# EAGLE schematic nixi-test-board (EAGLE 7.2.0)
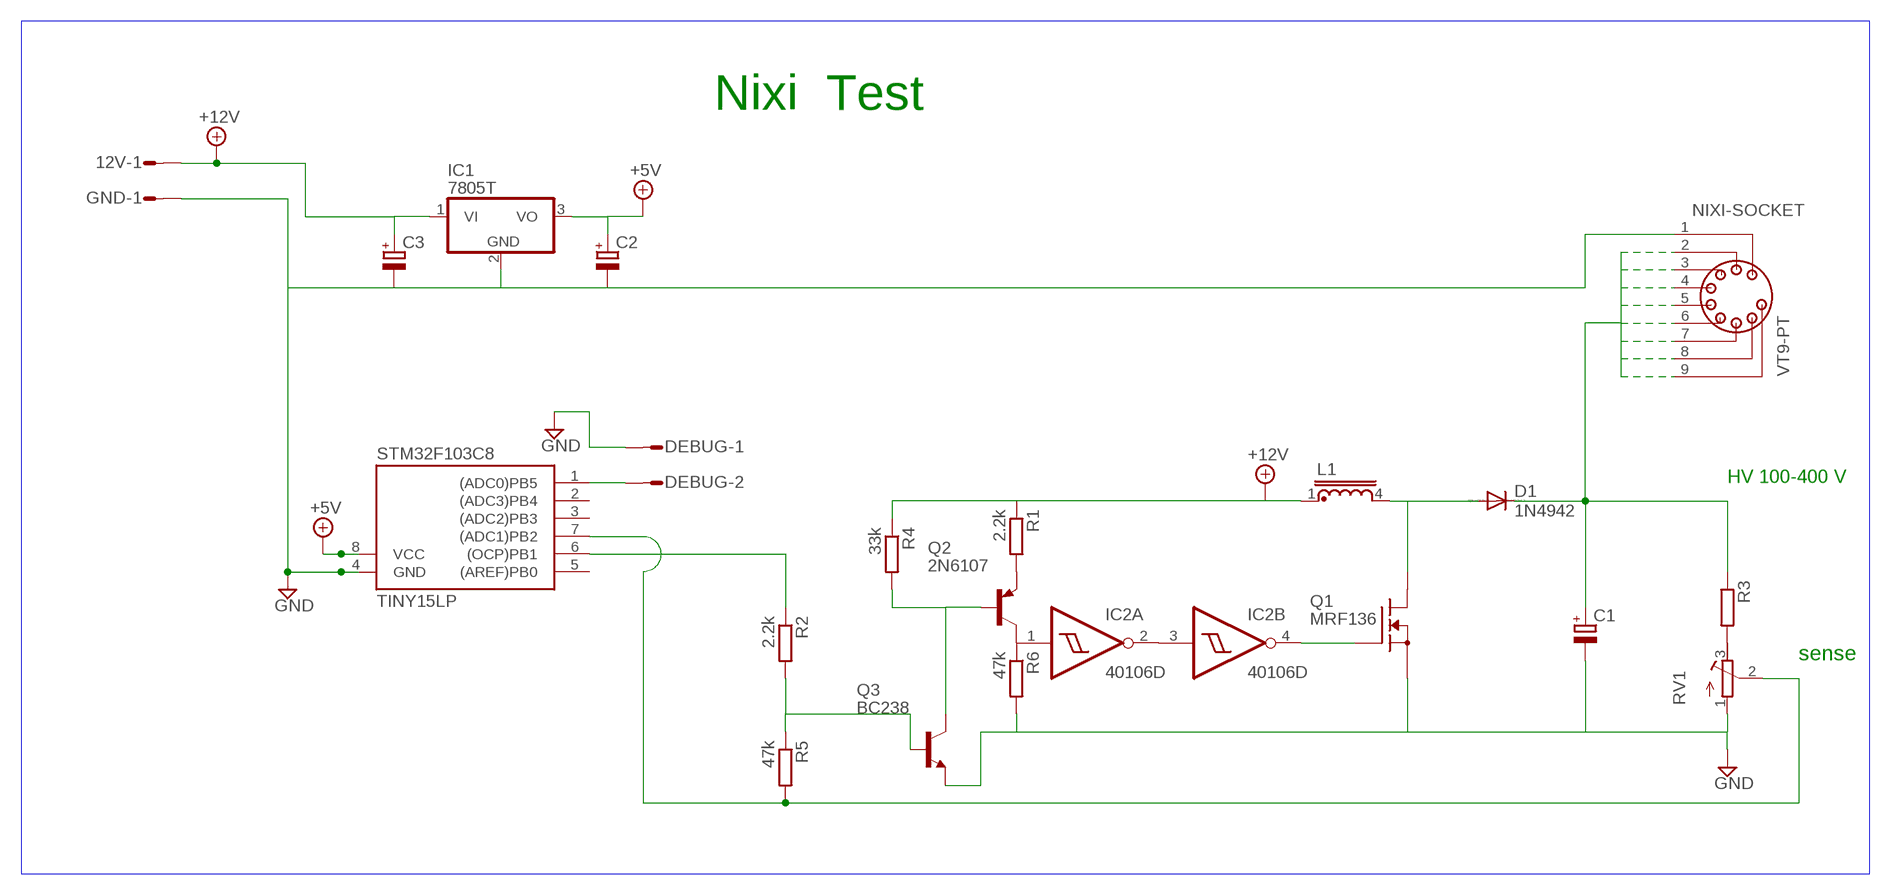
[diagram p0: schematic, sheet 1]

## Parts
12V  L02P  [L02P]
C1  CPOL-EU139CLL-2W  [139CLL-2W]
C2  CPOL-EU139CLL-2W  [139CLL-2W]
C3  CPOL-EU139CLL-2W  [139CLL-2W]
D1  1N4942  [DO41-10]
DEBUG  L02P  [L02P]
GND  L02P  [L02P]
IC1  7805T  [TO220H]
IC2  40106D  [SO14]
L1  U15-CHOKE  [U15CHOKE]
NIXI-SOCKET  VT9-PT  [VT9-PT]
Q1  MRF136  [211-07_SMD]
Q2  2N6107  [TO220]
Q3  BC238  [TO92]
R1  2.2k  R-EU_0207/5V  [0207/5V]
R2  2.2k  R-EU_0207/5V  [0207/5V]
R3  R-EU_0207/5V  [0207/5V]
R4  33k  R-EU_0207/5V  [0207/5V]
R5  47k  R-EU_0207/5V  [0207/5V]
R6  47k  R-EU_0207/5V  [0207/5V]
RV1  R-TRIMM4G/J  [RTRIM4G/J]
STM32F103C8  TINY15LP  [DIL08]

## Nets
+5V: C2.+ IC1.3(VO) STM32F103C8.8(VCC)
+12V: 12V.1 C3.+ IC1.1(VI) L1.1 R4.1
GND: C1.- C2.- C3.- DEBUG.1 GND.1 IC1.2(GND) NIXI-SOCKET.1 Q1.1(S) Q1.3(S) Q3.1(E) R6.2 RV1.1(E) STM32F103C8.4(GND)
N$1: DEBUG.2 STM32F103C8.1((ADC0)PB5)
N$2: D1.A L1.4 Q1.4(D)
N$3: IC2.4(B:O) Q1.2(G)
N$4: R3.2 RV1.3(A)
N$5: R5.2 RV1.2(S) STM32F103C8.7((ADC1)PB2)
N$7: R2.1 STM32F103C8.6((OCP)PB1)
N$8: Q3.2(B) R2.2 R5.1
N$9: IC2.2(A:O) IC2.3(B:I)
N$10: Q2.1(B) Q3.3(C) R4.2
N$11: C1.+ D1.C NIXI-SOCKET.2 NIXI-SOCKET.3 NIXI-SOCKET.4 NIXI-SOCKET.5 NIXI-SOCKET.6 NIXI-SOCKET.7 NIXI-SOCKET.8 NIXI-SOCKET.9 R3.1
N$13: Q2.3(E) R1.2
N$14: Q2.2(C) R6.1
N$15: IC2.1(A:I) R6.1
Unconnected: 12V.2 GND.2 IC2.5(C:I) IC2.6(C:O) IC2.8(D:O) IC2.9(D:I) IC2.10(E:O) IC2.11(E:I) IC2.12(F:O) IC2.13(F:I) R1.1 STM32F103C8.2((ADC3)PB4) STM32F103C8.3((ADC2)PB3) STM32F103C8.5((AREF)PB0)

## Notes on the sheet
- Nixi  Test
- HV 100-400 V
- sense

## Power pins joined to a net without a drawn wire
VDD: IC2.14(P:VDD)
VSS: IC2.7(P:VSS)

## Library data of the parts
12V DEBUG GND = con-amp-mt:L02P: AMP MT CONNECTOR; OC_FARNELL: unknown; OC_NEWARK: unknown
C1-C3 = resistor:CPOL-EU: POLARIZED CAPACITOR, European symbol
D1 = diode:1N4942: DIODE 1.0 A, 200 V, 150 ns
IC1 = linear:78*: Positive VOLTAGE REGULATOR Source: http://cache.national.com/ds/LM/LM78L05.pdf http://www.fairchildsemi.com/ds/LM/LM7805.pdf
IC2 = 40xx:40106: Hex SCHMITT TRIGGER
L1 = inductor-neosid:U15-: CHOKE U15; OC_FARNELL: unknown; OC_NEWARK: unknown
NIXI-SOCKET = belton-engineering:VT9: VACUUM TUBE SOCKET Source: 00004280-VT9-PT.pdf
Q1 = transistor-fet:MRF136: RF Power Field-Effect Transistor N-Channel Enhancement-Mode MOSFET, 15W, 400MHz Sopurce: http://www.macom.com/data/datasheet/MRF136.pdf
Q2 = transistor-pnp:2N6107: PNP Transistor
Q3 = transistor-npn:BC238: NPN Transistor
R1-R6 = resistor:R-EU_: RESISTOR, European symbol
RV1 = resistor:R-TRIMM: Trimm resistor
STM32F103C8 = atmel:TINY15L: MICROCONTROLLER 2.7 V 1 Kbytes FLASH 64 bytes EEPROM 4-channel 10 bit ADC; OC_FARNELL: unknown; OC_NEWARK: unknown